# Altium schematic sheet NavigationUnit.SchDoc
size 420 x 297 mm; SheetNumber: 1; SheetTotal: 1; Scale: 1:1; Разраб.: Калашников Д; Обозначение документа: ВКР-15.03.06-25-КДА-06.00.01; Пров.: Политов Е.Н.; Наименование организации: ЮЗГУ, МТ11-б; Перв. применение: АБВГ.123456.000; Наименование изделия 1: Плата навигационная; Наименование изделия 2: Схема электрическая; Наименование изделия 3: принципиальная; ДатаРазраб: 10.06.25; ДатаПров: 16.06.25
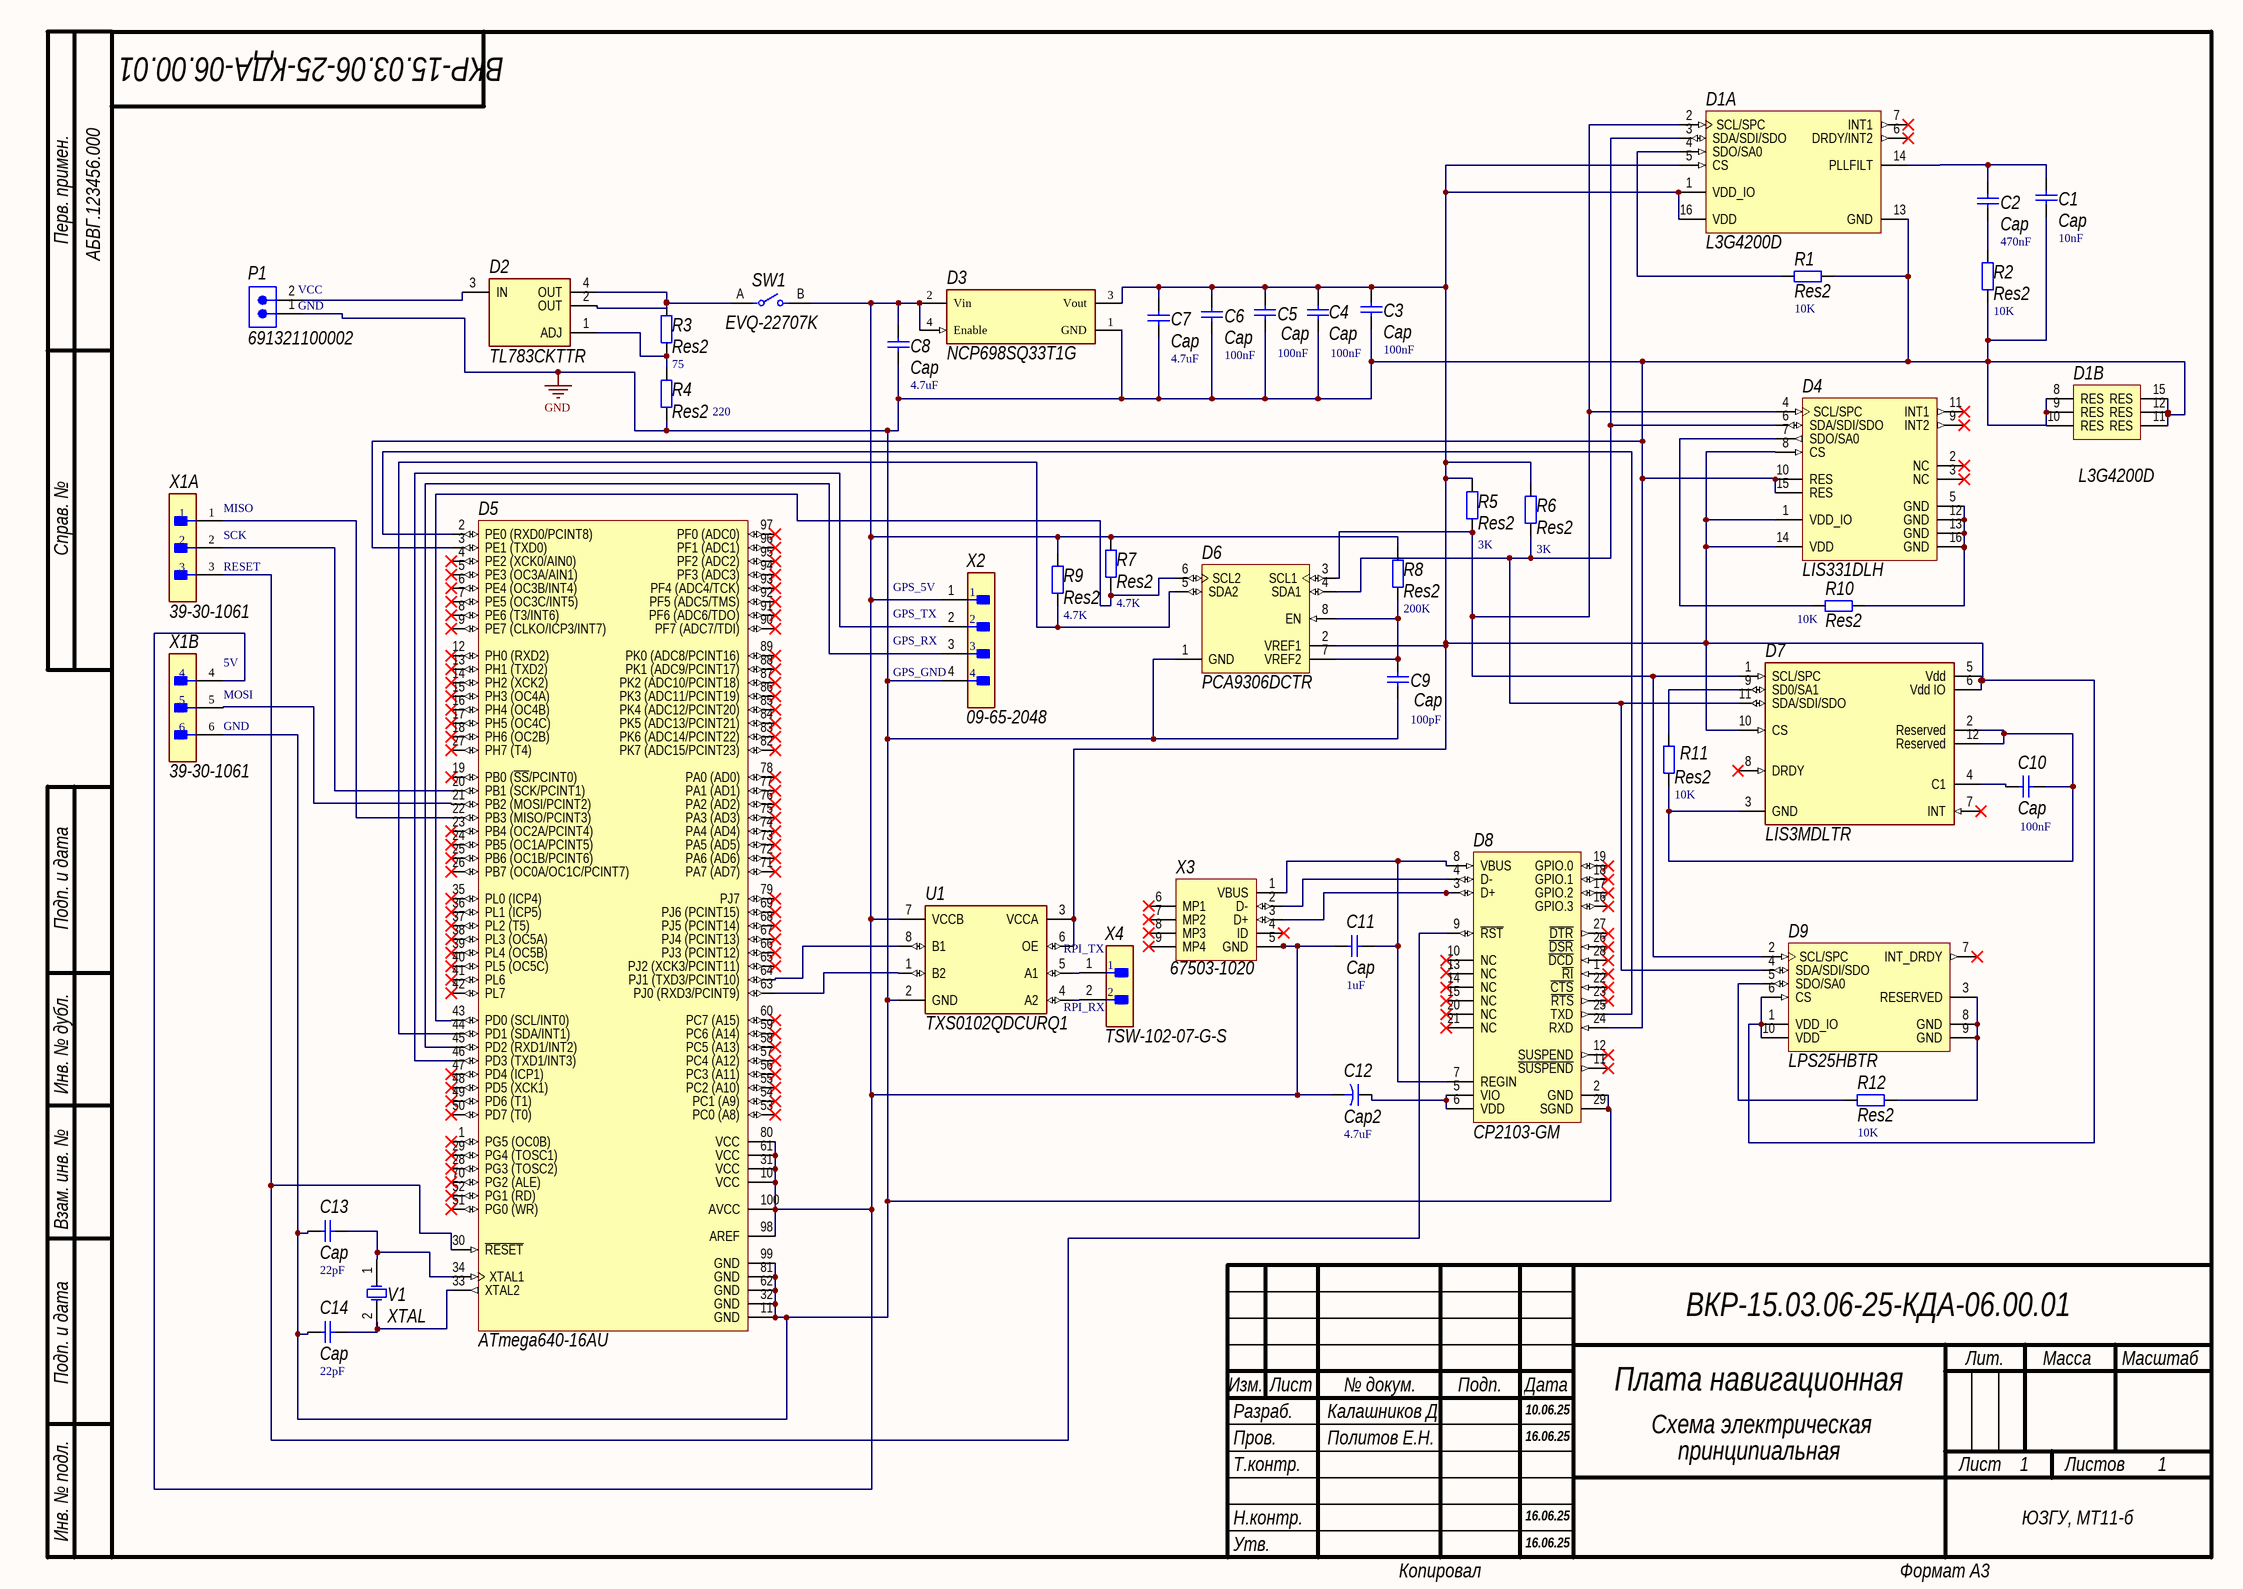
[diagram p0: NavigationUnit.SchDoc]

## Parts
C1  Cap  value 10nF  [RAD-0.3]
C2  Cap  value 470nF  [RAD-0.3]
C3  Cap  value 100nF  [RAD-0.3]
C4  Cap  value 100nF  [RAD-0.3]
C5  Cap  value 100nF  [RAD-0.3]
C6  Cap  value 100nF  [RAD-0.3]
C7  Cap  value 4.7uF  [RAD-0.3]
C8  Cap  value 4.7uF  [RAD-0.3]
C9  Cap  value 100pF  [RAD-0.3]
C10  Cap  value 100nF  [RAD-0.3]
C11  Cap  value 1uF  [RAD-0.3]
C12  Cap2  value 4.7uF  [CAPR5-4X5]
C13  Cap  value 22pF  [RAD-0.3]
C14  Cap  value 22pF  [RAD-0.3]
D1  L3G4200D  [STM-LGA16-4X4X1.1]  (parts A,B of 2)
D2  TL783CKTTR  [FP-KTT0003A-MFG]
D3  NCP698SQ33T1G  [FP-419C-02-MFG]
D4  LIS331DLH  [STM-LGA16-3X3X1]
D5  ATmega640-16AU  [100A_M]
D6  PCA9306DCTR  [DCT0008A_L]
D7  LIS3MDLTR  [FP-VFLGA-12-8365767-MFG]
D8  CP2103-GM  [SLAB-QFN-28-3125x3125TP_A_M]
D9  LPS25HBTR  [STM-LGA-10]
P1  691321100002  [691321100002]
R1  Res2  value 10K  [AXIAL-0.4]
R2  Res2  value 10K  [AXIAL-0.4]
R3  Res2  value 75  [AXIAL-0.4]
R4  Res2  value 220  [AXIAL-0.4]
R5  Res2  value 3K  [AXIAL-0.4]
R6  Res2  value 3K  [AXIAL-0.4]
R7  Res2  value 4.7K  [AXIAL-0.4]
R8  Res2  value 200K  [AXIAL-0.4]
R9  Res2  value 4.7K  [AXIAL-0.4]
R10  Res2  value 10K  [AXIAL-0.4]
R11  Res2  value 10K  [AXIAL-0.4]
R12  Res2  value 10K  [AXIAL-0.4]
SW1  EVQ-22707K  [FP-EVQ-22707K-MFG]
U1  TXS0102QDCURQ1  [FP-DCU0008A-MFG]
V1  XTAL  [R38]
X1  39-30-1061  [FP-39-30-1061-MFG]  (parts A,B of 2)
X2  09-65-2048  [FP-09-65-2048-MFG]
X3  67503-1020  [MOLX-67503-1020_V]
X4  TSW-102-07-G-S  [FP-TSW-102-07-G-S-MFG]

## Nets
GND: C1.2 C3.1 C4.1 C5.1 C6.1 C7.1 C8.1 C9.1 C13.2 C14.1 D1.8(RES) D1.9(RES) D1.11(RES) D1.12(RES) D1.13(GND) D1.15(RES) D3.1(GND) D4.10(RES) D4.15(RES) D5.3(PE1_(TXD0)) D5.11(GND) D5.32(GND) D5.62(GND) D5.81(GND) D5.99(GND) D6.1(GND) D8.2(GND) D8.24(RXD) D8.29(SGND) P1.1 R1.2 R2.2 R4.2 U1.2(GND) X1.6 X2.4
NetC1_1: C1.1 C2.1 D1.14(PLLFILT)
NetC2_2: C2.2 R2.1
NetC3_2: C3.2 C4.2 C5.2 C6.2 C7.2 D1.1(VDD_IO) D1.5(CS) D1.16(VDD) D3.3(Vout) D4.1(VDD_IO) D4.8(CS) D4.14(VDD) D6.2(VREF1) D7.5(Vdd) D7.6(Vdd_IO) D7.10(CS) D9.1(VDD_IO) D9.6(CS) D9.10(VDD) R5.1 R6.1 U1.3(VCCA) U1.6(OE)
NetC8_2: C8.2 C11.2 C12.2 D3.2(Vin) D3.4(Enable) D5.10(VCC) D5.31(VCC) D5.61(VCC) D5.80(VCC) D5.98(AREF) D5.100(AVCC) R7.1 R8.2 R9.1 SW1.B U1.7(VCCB) X1.4 X2.1 X3.5(GND)
NetC9_2: C9.2 D6.7(VREF2) D6.8(EN) R8.1
NetC10_1: C10.1 D7.2(Reserved) D7.3(GND) D7.12(Reserved) R11.1
NetC10_2: C10.2 D7.4(C1)
NetC11_1: C11.1 D8.7(REGIN) D8.8(VBUS) X3.1(VBUS)
NetC12_1: C12.1 D8.5(VIO) D8.6(VDD)
NetC13_1: C13.1 D5.34(XTAL1) V1.1(OSC1)
NetC14_2: C14.2 D5.33(XTAL2) V1.2(OSC2)
NetD1_2: D1.2(SCL/SPC) D4.4(SCL/SPC) D6.3(SCL1) D7.1(SCL/SPC) D9.2(SCL/SPC) R5.2
NetD1_3: D1.3(SDA/SDI/SDO) D4.6(SDA/SDI/SDO) D6.4(SDA1) D7.11(SDA/SDI/SDO) D9.4(SDA/SDI/SDO) R6.2
NetD1_4: D1.4(SDO/SA0) R1.1
NetD2_1: D2.1(ADJ) R3.2 R4.1
NetD2_2: D2.2(OUT) D2.4(OUT) R3.1 SW1.A
NetD2_3: D2.3(IN) P1.2
NetD4_5: D4.5(GND) D4.12(GND) D4.13(GND) D4.16(GND) R10.2
NetD4_7: D4.7(SDO/SA0) R10.1
NetD5_2: D5.2(PE0_(RXD0/PCINT8)) D8.25(TXD)
NetD5_20: D5.20(PB1_(SCK/PCINT1)) X1.2
NetD5_21: D5.21(PB2_(MOSI/PCINT2)) X1.5
NetD5_22: D5.22(PB3_(MISO/PCINT3)) X1.1
NetD5_30: D5.30(~{RESET}) D8.9(~{RST}) X1.3
NetD5_43: D5.43(PD0_(SCL/INT0)) D6.6(SCL2) R7.2
NetD5_44: D5.44(PD1_(SDA/INT1)) D6.5(SDA2) R9.2
NetD5_45: D5.45(PD2_(RXD1/INT2)) X2.3
NetD5_46: D5.46(PD3_(TXD1/INT3)) X2.2
NetD5_63: D5.63(PJ0_(RXD3/PCINT9)) U1.1(B2)
NetD5_64: D5.64(PJ1_(TXD3/PCINT10)) U1.8(B1)
NetD7_9: D7.9(SD0/SA1) R11.2
NetD8_3: D8.3(D+) X3.3(D+)
NetD8_4: D8.4(D-) X3.2(D-)
NetD9_3: D9.3(RESERVED) D9.8(GND) D9.9(GND) R12.2
NetD9_5: D9.5(SDO/SA0) R12.1
NetU1_4: U1.4(A2) X4.2
NetU1_5: U1.5(A1) X4.1

Not connected (* = marked no-connect by the designer): D1 6(DRDY/INT2)* 7(INT1)* 10(RES); D4 2(NC)* 3(NC)* 9(INT2)* 11(INT1)*; D5 1(PG5_(OC0B))* 4(PE2_(XCK0/AIN0))* 5(PE3_(OC3A/AIN1))* 6(PE4_(OC3B/INT4))* 7(PE5_(OC3C/INT5))* 8(PE6_(T3/INT6))* 9(PE7_(CLKO/ICP3/INT7))* 12(PH0_(RXD2))* 13(PH1_(TXD2))* 14(PH2_(XCK2))* 15(PH3_(OC4A))* 16(PH4_(OC4B))* 17(PH5_(OC4C))* 18(PH6_(OC2B))* 19(PB0_(~{SS}/PCINT0))* 23(PB4_(OC2A/PCINT4))* 24(PB5_(OC1A/PCINT5))* 25(PB6_(OC1B/PCINT6))* 26(PB7_(OC0A/OC1C/PCINT7))* 27(PH7_(T4))* 28(PG3_(TOSC2))* 29(PG4_(TOSC1))* 35(PL0_(ICP4))* 36(PL1_(ICP5))* 37(PL2_(T5))* 38(PL3_(OC5A))* 39(PL4_(OC5B))* 40(PL5_(OC5C))* 41(PL6)* 42(PL7)* 47(PD4_(ICP1))* 48(PD5_(XCK1))* 49(PD6_(T1))* 50(PD7_(T0))* 51(PG0_(WR))* 52(PG1_(RD))* 53(PC0_(A8))* 54(PC1_(A9))* 55(PC2_(A10))* 56(PC3_(A11))* 57(PC4_(A12))* 58(PC5_(A13))* 59(PC6_(A14))* 60(PC7_(A15))* 65(PJ2_(XCK3/PCINT11))* 66(PJ3_(PCINT12))* 67(PJ4_(PCINT13))* 68(PJ5_(PCINT14))* 69(PJ6_(PCINT15))* 70(PG2_(ALE))* 71(PA7_(AD7))* 72(PA6_(AD6))* 73(PA5_(AD5))* 74(PA4_(AD4))* 75(PA3_(AD3))* 76(PA2_(AD2))* 77(PA1_(AD1))* 78(PA0_(AD0))* 79(PJ7)* 82(PK7_(ADC15/PCINT23))* 83(PK6_(ADC14/PCINT22))* 84(PK5_(ADC13/PCINT21))* 85(PK4_(ADC12/PCINT20))* 86(PK3_(ADC11/PCINT19))* 87(PK2_(ADC10/PCINT18))* 88(PK1_(ADC9/PCINT17))* 89(PK0_(ADC8/PCINT16))* 90(PF7_(ADC7/TDI))* 91(PF6_(ADC6/TDO))* 92(PF5_(ADC5/TMS))* 93(PF4_(ADC4/TCK))* 94(PF3_(ADC3))* 95(PF2_(ADC2))* 96(PF1_(ADC1))* 97(PF0_(ADC0))*; D7 7(INT)* 8(DRDY)*; D8 1(~{RI})* 10(NC)* 11(~{SUSPEND})* 12(SUSPEND)* 13(NC) 14(NC)* 15(NC)* 16(GPIO.3)* 17(GPIO.2)* 18(GPIO.1)* 19(GPIO.0)* 20(NC)* 21(NC)* 22(~{CTS})* 23(~{RTS})* 26(~{DSR})* 27(~{DTR})* 28(~{DCD})*; D9 7(INT_DRDY)*; X3 4(ID)* 6(MP1)* 7(MP2)* 8(MP3)* 9(MP4)*

## Notes on the sheet
- (near P1) VCC
- (near P1) GND
- (near X1) MISO
- (near X1) SCK
- (near X1) RESET
- (near X2) GPS_5V
- (near X1) 5V
- (near X2) GPS_RX
- (near X2) GPS_TX
- (near X1) GND
- (near X1) MOSI
- (near X2) GPS_GND
- RPI_TX
- (near X4) RPI_RX
- Перв. примен.
- Справ. №
- Подп. и дата
- Инв. № дубл.
- Взам. инв. №
- Разраб.
- Изм.
- Лист
- № докум.
- Подп.
- Дата
- Лит.
- Масса
- Масштаб
- Пров.
- Т.контр.
- Листов
- Инв. № подл.
- Утв.
- Н.контр.
- Копировал
- Формат А3

## Library data of the parts
C1-C11 C13 C14 = Cap: Capacitor; Published: 8-Jun-2000; LatestRevisionDate: 17-Jul-2002; LatestRevisionNote: Re-released for DXP Platform.; PackageReference: RAD-0.3; Publisher: Altium Limited; PackageDescription: Radial Cap, Thru-Hole; 2 Leads; 0.3 in Pin Spacing
C12 = Cap2: Capacitor; Published: 23-Sep-2002; PackageReference: CAPR5-4X5; Publisher: Altium Limited; PackageDescription: Capacitor; 2 Leads
D1 = CMP-0234-00071-2: MEMS motion sensor: ultra-stable three-axis digital output gyroscope, -40 to +85°C, LGA-16 (4x4x1.1), Tray; ComponentLink2URL: http://www.st.com/internet/analog/product/250373.jsp; ComponentLink1Description: L3G4200D Datasheet; DatasheetVersion: rev3, Dec-2010; ComponentLink3URL: http://www.st.com/internet/com/home/home.jsp; PackageVersion: 2010; PackageReference: LGA16-4X4X1.1; PackageDescription: 16-Pin Land Grid Array Package, 4 x 4 x 1.1 mm Body, 0.65 mm Pitch; ComponentLink2Description: L3G4200D Web Page; ComponentLink3Description: st.com Home; ComponentLink1URL: http://www.st.com/internet/com/TECHNICAL_RESOURCES/TECHNICAL_LITERATURE/DATASHEET/CD00265057.pdf
D2 = CMP-04917-000064-1: IC REG LIN POS ADJ 700MA DDPAK; Max Input Voltage: 150V; Polarity: Positive; Number of Regulators: 1; Min Input Voltage: 21.5V; Reference Voltage: 1.3V; Output Voltage: 125V; Dropout Voltage: 10V; Output Type: Adjustable; Power Supply Rejection Ratio (PSRR): 76dB; Quiescent Current: 15mA; Min Output Voltage: 1.25V; Weight: 0.050897oz; Height: 4.44mm; Package Quantity: 1; Min Operating Temperature: 0°C; Case/Package: TO-263; Packaging: Tape and Reel; REACH SVHC: No SVHC; Lead Free: Lead Free; Width: 8.41mm; Radiation Hardening: No; Number of Pins: 3; Output Current: 700mA; Number of Outputs: 1; Max Operating Temperature: 125°C; Min Current Limit: 700mA; Mount: Surface Mount; Max Output Current: 700mA; Max Output Voltage: 125V; Length: 10.18mm
D3 = CMP-00278-07868312-1: NCP698SQ33T1G Linear Voltage Regulator, CMOS LDO, Low Iq and Low IGND, 150 mA, V out : 3.3 V; Manufacturer Lifecycle Status: ACTIVE; Output Voltage Accuracy: 2%; Max Output Current: 150mA; Number of Outputs: 1; Nominal Output Voltage: 3.3V; Polarity: Positive; Max Supply Voltage: 6V; Max Junction Temperature (Tj): 150°C; Min Supply Voltage: 4.3V; Nominal Supply Current: 2.5µA; Dropout Voltage: 370mV; Output Type: Fixed; Min Output Voltage: 3.3V; Number of Regulators: 1; Accuracy: 2%; Halogen Free: Halogen Free; Length: 2.1844mm; Number of Channels: 1; Height: 990.6µm; Max Input Voltage: 6V; Radiation Hardening: No; Output Voltage: 3.3V; Lead Free: Lead Free; Input Bias Current: 2.5µA; REACH SVHC: No SVHC; Lifecycle Status: Production; Mount: Surface Mount; Width: 1.3462mm; Schedule B: 8542390000, 8542390000; Output Current: 150mA; Quiescent Current: 2.5µA; Number of Pins: 4; RoHS: Compliant; Operating Supply Voltage: 6V; Ambient Temperature Range High: 85°C; Max Operating Temperature: 85°C; NexarPartId: 7868312; Packaging: Tape & Reel (TR); Min Operating Temperature: -40°C
D4 = CMP-0234-00067-3: MEMS motion sensor: Ultra low power high performance 3-axis nano accelerometer, -40 to +85°C, LGA-16 (3x3x1), Tray; Manufacturer: STMicroelectronics; PackageVersion: 2008; RevisionNote: PCB layout corrected.; ComponentLink2Description: LIS331DLH Datasheet; ComponentLink1Description: Manufacturer URL; DatasheetVersion: rev3, Jul-2009; PackageReference: LGA16-3X3X1; ComponentLink1URL: http://www.st.com/; ComponentLink3URL: http://www.st.com/internet/analog/product/218132.jsp; PackageDescription: 16-Pin Land Grid Array, 3 x 3 x 1 mm Body, 0.5 mm Pitch; ComponentLink3Description: LIS331DLH Web Page; ComponentLink2URL: http://www.st.com/internet/com/TECHNICAL_RESOURCES/TECHNICAL_LITERATURE/DATASHEET/CD00213470.pdf
D5 = CMP-0095-00194-2: 8-bit AVR Microcontroller, 2.7-5.5V, 8MHz, 64KB Flash, 4KB EEPROM, 8KB SRAM, 86 GPIO pins, 100-pin TQFP, Industrial Grade (-40°C to 85°C), Pb-Free; Code_JEDEC: MS-026-AED; ComponentLink1URL: http://www.atmel.com/; RevisionNote: DatasheetVersion & PackageVersion updated. URLs added.; DatasheetVersion: revN, May-2011; ComponentLink3Description: ATmega640/1280/1281/2560/2561 Summary; ComponentLink1Description: Manufacturer URL; ComponentLink2Description: ATmega640/1280/1281/2560/2561 Datasheet; ComponentLink2URL: http://www.atmel.com/dyn/resources/prod_documents/doc2549.pdf; ComponentLink3URL: http://www.atmel.com/dyn/resources/prod_documents/2549S.pdf; PackageVersion: revD, Oct-2010; PackageReference: 100A; PackageDescription: 100-Pin Thin Profile Plastic Quad Flat Pack (TQFP), 14 x 14 x 1.0 mm Body, 0.5 mm Pitch
D6 = CMP-0314-00283-2: Dual Bi-Directional I2C-Bus and SMBus Voltage Level-Translator, 0 to 5.5 V, -40 to 85 degC, 8-pin SM8 (DCT), Green (RoHS & no Sb/Br); Manufacturer: Texas Instruments; Enable Pin: Yes; Function: Voltage Translator; tpd max(ns): 1.5; Rating: Catalog; SubFamily: I2C Special Function; Max Frequency(kHz): 400; Vcc range(V): 0 to 5.5; No. of Outputs: 2; Eco-Plan: Green (RoHS & no Sb/Br); PartNumber: PCA9306DCTR; Mounting Technology: Surface Mount; 5V Tolerant I/O: Yes; ComponentLink2Description: Package Specification; ComponentLink1Description: Datasheet; On-Chip Power-on-Reset: No; PackageVersion: revC, Sep-2002; DatasheetVersion: SCPS113J; PackageDescription: 8-Pin Thin Small Outline Package 3 x 2.8 mm Body ,0.65 mm Pitch; Open Drain I/O Type: Yes; ComponentLink1URL: http://www.ti.com/general/docs/lit/getliterature.tsp?genericPartNumber=PCA9306&fileType=pdf; Code_JEDEC: MO-187-DA; PackageReference: DCT0008A; ComponentLink2URL: http://www.ti.com/litv/pdf/mpds049b; fSCLK(Max)(MHz): 400
D7 = CMP-2000-07463-2: SENSOR MR I2C/SPI 12LGA; Manufacturer: STMicroelectronics; Sensor Output: I2C,SPI; Operating Supply Current: 40-270uA; Max Supply Voltage: 3.6V; Sensing Method: Magnetic; Min Supply Voltage: 1.71V; ComponentLink2URL: https://www.st.com/resource/en/datasheet/lis3mdl.pdf; Category: IC; Manufacturer Part Number: LIS3MDLTR; Octopart: https://octopart.com/lis3mdltr-stmicroelectronics-29403125; Automotive: No; ComponentLink2Description: Datasheet; RoHS: TRUE; Device Class L3: unset; Device Class L1: Sensors; Temperature: -40°C to +85°C; Height: 1mm; Mouser Description: Board Mount Hall Effect / Magnetic Sensors Ultra Lo-Pwr Hi Perf 3-Axis 1.9-3.6V; Temperature Range High: +85°C; Lead Free: Yes; Device Class L2: Magnetic Sensors; Footprint Url: https://www.st.com/content/ccc/resource/technical/document/technical_note/73/17/9c/16/dd/96/4a/01/CD00134799.pdf/files/CD00134799.pdf/jcr:content/translations/en.CD00134799.pdf; Temperature Range Low: -40°C; Package: VFLGA-12-8365767; Digikey Description: SENSOR MR I2C/SPI 12LGA
D8 = CMP-0511-00006-1: Single-Chip USB to UART Bridge, 1024 Bytes EEPROM, -40 to 85 degC, 28-pin QFN, Tube; Manufacturer: Silicon Labs; Internal Oscillator: TRUE; Sub-Family: USB Bridges; PackageDescription: 28-Pin Quad-Flat No-Leads Package, Body 5 x 5 mm, Pitch 0.5 mm; PartNumber: CP2103-GM; ComponentLink2Description: Datasheet; ComponentLink2URL: http://www.silabs.com/Support%20Documents/TechnicalDocs/CP2103.pdf; ComponentLink1URL: http://www.silabs.com/; Mounting Technology: Surface Mount; ComponentLink1Description: Manufacturer URL; PackageReference: QFN-28; EEPROM: 1024 Bytes; DatasheetVersion: Rev. 1.0; ComponentLink3Description: Package Specification; ComponentLink3URL: http://www.silabs.com/Support%20Documents/TechnicalDocs/C8051F35x.pdf
D9 = CMP-2000-06573-1: MEMS Pressure Sensor: 260 - 1260 hPa Absolute Digital Output Barometer, 1.7 to 3.6 V, -30 to 105 degC, 10-Pin LGA, RoHS, Tape and Reel; Manufacturer: STMicroelectronics; Voltage - Supply: 1.7V~3.6V; Output: 24b; Maximum Pressure: 290.08PSI(2000kPa); Operating Pressure: 3.77PSI~18.27PSI(26kPa~126kPa); Port Style: NoPort; Accuracy: ±0.003PSI(±0.02kPa); Output Type: I²C,SPI; Pressure Type: Absolute; PartNumber: LPS25HB; Package Description: 10-Pin Holed Land Grid Array, Body 2.5 x 2.5 mm, Pitch 0.6 mm; Supplier Device Package: 10-LLGA(2.5x2.5); Operating Temperature: -30°C~105°C; Mounting Technology: SurfaceMount; Port Size: -; Family: PressureSensors,Transducers; Datasheet Version: Rev. 2, 05/2015; Category: Sensors,Transducers; Termination Style: SolderPad; Package URL: http://www.st.com/st-web-ui/static/active/en/resource/technical/document/datasheet/DM00141379.pdf; Series: -; Manufacturer URL: http://www.st.com/; Datasheet URL: http://www.st.com/st-web-ui/static/active/en/resource/technical/document/datasheet/DM00141379.pdf; Package Reference: LGA-10; Package / Case: 10-VFLGA; Features: TemperatureCompensated
P1 = CMP-1502-01783-2: NexarPartId: 18818340; Current Rating: 10A; Voltage: 300V; Pitch: 3.5052mm; Number of Contacts: 2; Number of Levels: 1; Gender: Male; Termination: Solder; Lead Free: Lead Free; Number of Rows: 1; Contact Material: Brass; Width: 8.1mm; Length: 7mm; Voltage Rating: 300V; Min Operating Temperature: -40°C; Number of Pins: 2; Height: 7.2mm; Mount: Through Hole; Max Operating Temperature: 105°C; RoHS: Compliant; Orientation: Vertical; Number of Positions Per Level: 2; Current: 10A; REACH SVHC: Unknown; Color: Green; Lead Pitch: 3.5mm; Packaging: Box
R1-R12 = Res2: Resistor; Published: 8-Jun-2000; LatestRevisionDate: 17-Jul-2002; LatestRevisionNote: Re-released for DXP Platform.; PackageReference: AXIAL-0.4; Publisher: Altium Limited; PackageDescription: Axial Device, Thru-Hole; 2 Leads; 0.4 in Pin Spacing
SW1 = CMP-05618-000065-1: SWITCH TACTILE SPST-NO 0.02A 15V; Contact Resistance: 50mR; Actuator Color: Black; Actuator Length: 3.6mm; Illumination Type: Non-Illuminated; Switch Travel: 0.25mm; Current Rating: 20mA; Operating Force: 2.6N; Throw Configuration: SPST; Actuator Type: Standard; Mechanical Life: 50000Cycles; Switch Function: Off-Mom; Size: 6mm; Max Voltage Rating (DC): 15V; Package Quantity: 1; Orientation: Straight; Max Operating Temperature: 70°C; Packaging: Tape and Reel; Lead Free: Lead Free; Termination: PC Pin; Radiation Hardening: No; Min Operating Temperature: -20°C; Series: EVQ2; Mount: Through Hole; Contact Current Rating: 20mA; Case/Package: Radial; Voltage Rating (DC): 15V; RoHS Compliant: Yes; Electrical Life: 50000Cycles
U1 = CMP-0859-00579-4: IC TRNSLTR BIDIRECTIONAL US8; Manufacturer: Texas Instruments; Number Of Inputs: 1; Logic Function Desc: Non-Inverting; V B Min: 2.3V; Data Rate: 2-24Mbits/s; V A Min: 1.65V; Standoff Height: 0mm; Propagation Delay: 0.5-50ns; V A Max: 3.6V; Max Supply Voltage: 5.5V; Max Junction Temp: +150°C; Automotive Grade: Grade 1; Nominal Supply Current: 25uA; Automotive: Yes; Octopart: https://octopart.com/txs0102qdcurq1-texas+instruments-46957249; ComponentLink2Description: Datasheet; Temperature Range Low: -40°C; Height: 0.9mm; Lead Free: Yes; Device Class L3: Voltage Level Shifters; RoHS: TRUE; Device Class L2: Logic ICs; Temperature: -40°C to +125°C; Device Class L1: Integrated Circuits (ICs); Digikey Description: IC TRNSLTR BIDIRECTIONAL US8; Manufacturer Part Number: TXS0102QDCURQ1; Ambient Temperature Range High: +125°C; Category: IC; ComponentLink2URL: http://www.ti.com/lit/ds/symlink/txs0102-q1.pdf; Mouser Description: 2-Bit Bidirectional Voltage-Level Translator For Open-Drain And Push-Pull Applications; Ambient Temperature Range Low: -40°C; Number Of Outputs: 1; Number Of Circuits: 1; Temperature Range High: +125°C; Package: DCU0008A; Min Supply Voltage: 1.65V; V B Max: 5.5V
V1 = XTAL: Crystal Oscillator; Published: 8-Jun-2000; LatestRevisionDate: 17-Jul-2002; LatestRevisionNote: Re-released for DXP Platform.; PackageReference: R38; Publisher: Altium Limited; PackageDescription: Crystal, Thru-Hole; 2 Leads; Body 3.1 x 8.2 mm (Dia.xH)
X1 = CMP-00257-00276738-1: 39-30-1061 Connector Wire to Board Header 6 Position 4.2mm Solder Right Angle Thru-Hole Tray; NexarPartId: 276738; Number of Positions: 6; Insulation Resistance: 1GΩ; Number of Ports: 1; Current Rating: 8A; Contact Resistance: 10mΩ; Gender: Male; Max Current Rating: 5A; Voltage Rating (DC): 600V; Glow Wire Compliant: Non-compliant; Termination: Solder; Min Operating Temperature: -40°C; Length: 13.8mm; Number of Circuits: 6; REACH SVHC: Unknown; RoHS: Compliant; Row Spacing: 4.2mm; Material: Brass; Housing Color: Natural; Contact Plating: Gold; Number of Rows: 2; Packaging: Bulk; Color: Natural; Height: 5.57mm; ELV: Compliant; Schedule B: 8536694040; Halogen Free: Low Halogen; Contact Gender: Male; Mount: Surface Mount, Through Hole; Housing Material: Nylon; Number of Contacts: 6; Contact Material: Brass, Gold; Lead Pitch: 4.2mm; Radiation Hardening: No; Pitch: 4.2mm; Lead Free: Lead Free; Depth: 19.4mm; Number of Terminals: 6; Flammability Rating: UL94 V-2; Orientation: Right Angle; Voltage Rating: 600V; Max Operating Temperature: 105°C
X2 = CMP-04776-000474-1: CONN HEADER VERT 4POS 3.96MM; Glow Wire Compliant: Non-compliant; Current Rating: 7A; Max Current Rating: 3A; Number of Contacts: 4; Insulation Resistance: 1GR; Voltage Rating (DC): 250V; Contact Resistance: 10mR; Gender: Male; Length: 12.88mm; Packaging: Bulk; Flammability Rating: UL94 V-2; RoHS Compliant: Yes; Housing Material: Nylon; Pitch: 3.96mm; Contact Gender: Male; Orientation: Straight; Housing Color: Natural; Min Operating Temperature: -40°C; Series: 5273; Lead Free: Lead Free; Package Quantity: 6000; Max Voltage Rating (AC): 250V; Radiation Hardening: No; Termination: Through Hole; Depth: 2.29mm; Contact Material: Brass; Number of Positions: 4; Height: 2.03mm; Contact Plating: Tin; Number of Rows: 1; Mount: Through Hole; Voltage Rating: 250V; Max Operating Temperature: 105°C
X3 = CMP-0411-00002-1: USB, MINI, SMD, RA KME04-USBMU03A01; Manufacturer: Molex; ComponentLink1URL: http://www.molex.com/; PartNumber: 67503-1020; Mounting Technology: Surface Mount; ComponentLink1Description: Manufacturer URL; Terminal Pitch: 0.8 mm; DatasheetVersion: Rev F, 06/2009; ComponentLink2Description: Datasheet; PackageDescription: Mini USB Connector, SMT, Righer Angle; ComponentLink2URL: http://www.molex.com/pdm_docs/sd/675031020_sd.pdf; PackageReference: 67503-1020
X4 = CMP-02766-000084-1: CONN HEADER VERT 2POS 2.54MM; Manufacturer: Samtec; Number Of Contacts: 2; Voltage Rating: 550V; Conn Orientation: Straight; Current Rating: 6.3A; Conn Gender: Male; Package: TSW-102-07-G-S; Digikey Description: CONN HEADER VERT 2POS 2.54MM; ComponentLink2URL: http://suddendocs.samtec.com/catalog_english/tsw_th.pdf; Height: 8.71mm; Temperature: -55°C to +125°C; Device Class L2: Headers and Wire Housings; ComponentLink2Description: Datasheet; Device Class L3: unset; Contact Material: Gold,Nickel; Temperature Range Low: -55°C; Temperature Range High: +125°C; RoHS: TRUE; Device Class L1: Connectors; Mouser Description: Conn Unshrouded Header HDR 2 POS 2.54mm Solder ST Thru-Hole Automotive Bulk; Number Of Rows: 1; Category: Conn; Pitch: 2.54mm; Lead Free: Yes; Automotive: No; Manufacturer Part Number: TSW-102-07-G-S; Footprint Url: http://suddendocs.samtec.com/prints/tsw-xxx-xx-x-x-xx-xxx-footprint.pdf; Octopart: https://octopart.com/tsw-102-07-g-s-samtec-272197